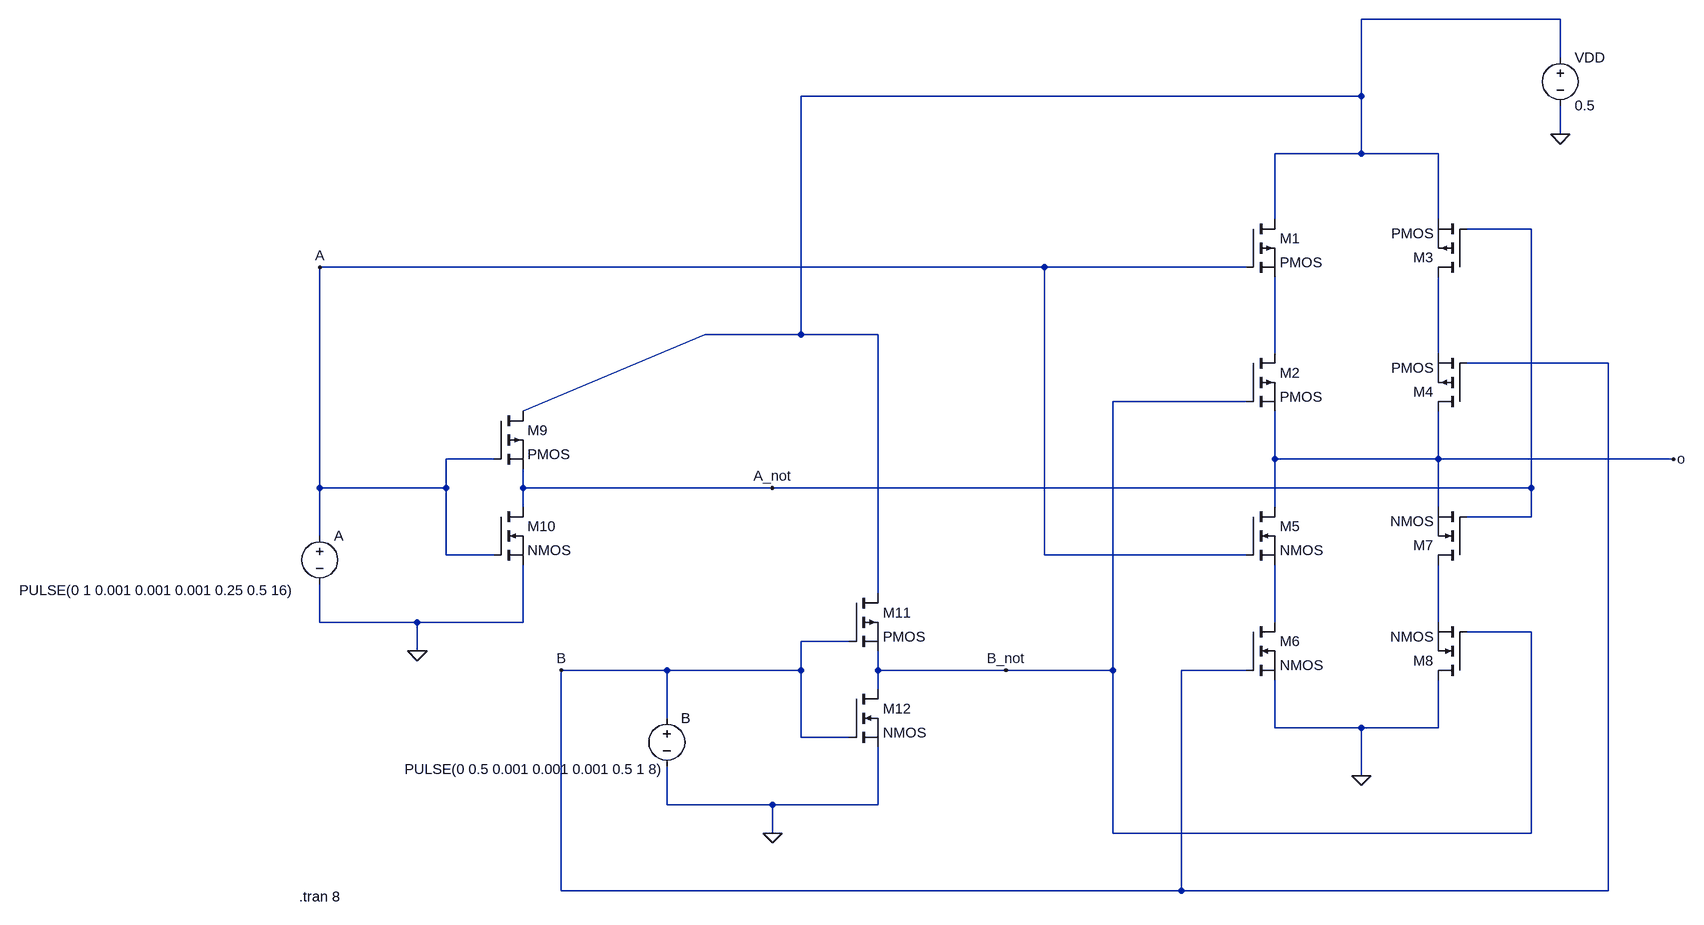
[diagram p0: schematic proj4Zayeed.asc]
proj4Zayeed.asc, the LTspice schematic file:
Version 4
SHEET 1 1336 972
WIRE 320 -528 -48 -528
WIRE 320 -464 320 -528
WIRE -48 -400 -48 -528
WIRE -48 -400 -1152 -400
WIRE 320 -336 320 -384
WIRE -48 -304 -48 -400
WIRE -48 -304 -192 -304
WIRE 80 -304 -48 -304
WIRE -192 -176 -192 -304
WIRE 80 -176 80 -304
WIRE 272 -160 128 -160
WIRE -720 -96 -1968 -96
WIRE -240 -96 -720 -96
WIRE -1152 16 -1152 -400
WIRE -1152 16 -1312 16
WIRE -1024 16 -1152 16
WIRE -192 48 -192 -80
WIRE 80 48 80 -80
WIRE 400 64 128 64
WIRE -240 128 -544 128
WIRE -1616 144 -1312 16
WIRE -1664 224 -1744 224
WIRE -192 224 -192 144
WIRE 80 224 80 144
WIRE 80 224 -192 224
WIRE 784 224 80 224
WIRE -1968 272 -1968 -96
WIRE -1744 272 -1744 224
WIRE -1744 272 -1968 272
WIRE -1616 272 -1616 240
WIRE -1200 272 -1616 272
WIRE 272 272 272 -160
WIRE 272 272 -1200 272
WIRE -1616 304 -1616 272
WIRE -192 304 -192 224
WIRE 80 304 80 224
WIRE 272 320 272 272
WIRE 272 320 128 320
WIRE -1968 352 -1968 272
WIRE -1744 384 -1744 272
WIRE -1664 384 -1744 384
WIRE -720 384 -720 -96
WIRE -240 384 -720 384
WIRE -1024 448 -1024 16
WIRE -1968 496 -1968 432
WIRE -1792 496 -1968 496
WIRE -1616 496 -1616 400
WIRE -1616 496 -1792 496
WIRE -192 496 -192 400
WIRE 80 496 80 400
WIRE 272 512 128 512
WIRE -1072 528 -1152 528
WIRE -1792 544 -1792 496
WIRE -1376 576 -1552 576
WIRE -1152 576 -1152 528
WIRE -1152 576 -1376 576
WIRE -1024 576 -1024 544
WIRE -784 576 -1024 576
WIRE -544 576 -544 128
WIRE -544 576 -784 576
WIRE -240 576 -400 576
WIRE -1024 608 -1024 576
WIRE -1376 656 -1376 576
WIRE -192 672 -192 592
WIRE -48 672 -192 672
WIRE 80 672 80 592
WIRE 80 672 -48 672
WIRE -1152 688 -1152 576
WIRE -1072 688 -1152 688
WIRE -48 752 -48 672
WIRE -1376 800 -1376 736
WIRE -1200 800 -1376 800
WIRE -1024 800 -1024 704
WIRE -1024 800 -1200 800
WIRE -1200 848 -1200 800
WIRE -544 848 -544 576
WIRE 272 848 272 512
WIRE 272 848 -544 848
WIRE -1552 944 -1552 576
WIRE -400 944 -400 576
WIRE -400 944 -1552 944
WIRE 400 944 400 64
WIRE 400 944 -400 944
FLAG -48 752 0
FLAG -1792 544 0
FLAG -1200 848 0
FLAG -1200 272 A_not
FLAG -784 576 B_not
FLAG -1968 -96 A
FLAG -1552 576 B
FLAG 784 224 o
FLAG 320 -336 0
SYMBOL pmos -240 -176 R0
SYMATTR InstName M1
SYMBOL pmos -240 48 R0
SYMATTR InstName M2
SYMBOL pmos 128 -80 R180
SYMATTR InstName M3
SYMBOL pmos 128 144 R180
SYMATTR InstName M4
SYMBOL nmos -240 304 R0
SYMATTR InstName M5
SYMBOL nmos -240 496 R0
SYMATTR InstName M6
SYMBOL nmos 128 400 R180
SYMATTR InstName M7
SYMBOL nmos 128 592 R180
SYMATTR InstName M8
SYMBOL voltage 320 -480 R0
WINDOW 123 0 0 Left 0
WINDOW 39 0 0 Left 0
SYMATTR InstName VDD
SYMATTR Value 0.5
SYMBOL pmos -1664 144 R0
SYMATTR InstName M9
SYMBOL nmos -1664 304 R0
SYMATTR InstName M10
SYMBOL voltage -1968 336 R0
WINDOW 3 -501 107 Left 2
WINDOW 123 0 0 Left 0
WINDOW 39 0 0 Left 0
SYMATTR InstName A
SYMATTR Value PULSE(0 1 0.001 0.001 0.001 0.25 0.5 16)
SYMBOL pmos -1072 448 R0
SYMATTR InstName M11
SYMBOL nmos -1072 608 R0
SYMATTR InstName M12
SYMBOL voltage -1376 640 R0
WINDOW 3 -437 101 Left 2
WINDOW 123 0 0 Left 0
WINDOW 39 0 0 Left 0
SYMATTR InstName B
SYMATTR Value PULSE(0 0.5 0.001 0.001 0.001 0.5 1 8)
TEXT -2002 954 Left 2 !.tran 8

The netlist it stands for:
* proj4Zayeed.asc
M1 N001 A N002 N002 PMOS
M2 N002 B_not o o PMOS
M3 N003 A_not N001 N001 PMOS
M4 o B N003 N003 PMOS
M5 o A N004 N004 NMOS
M6 N004 B 0 0 NMOS
M7 N005 A_not o o NMOS
M8 0 B_not N005 N005 NMOS
VDD N001 0 0.5
M9 N001 A A_not A_not PMOS
M10 A_not A 0 0 NMOS
V§A A 0 PULSE(0 1 0.001 0.001 0.001 0.25 0.5 16)
M11 N001 B B_not B_not PMOS
M12 B_not B 0 0 NMOS
V§B B 0 PULSE(0 0.5 0.001 0.001 0.001 0.5 1 8)
.model NMOS NMOS
.model PMOS PMOS
.lib standard.mos
.tran 8
.backanno
.end